# Altium project MotherPetit.PrjPCB
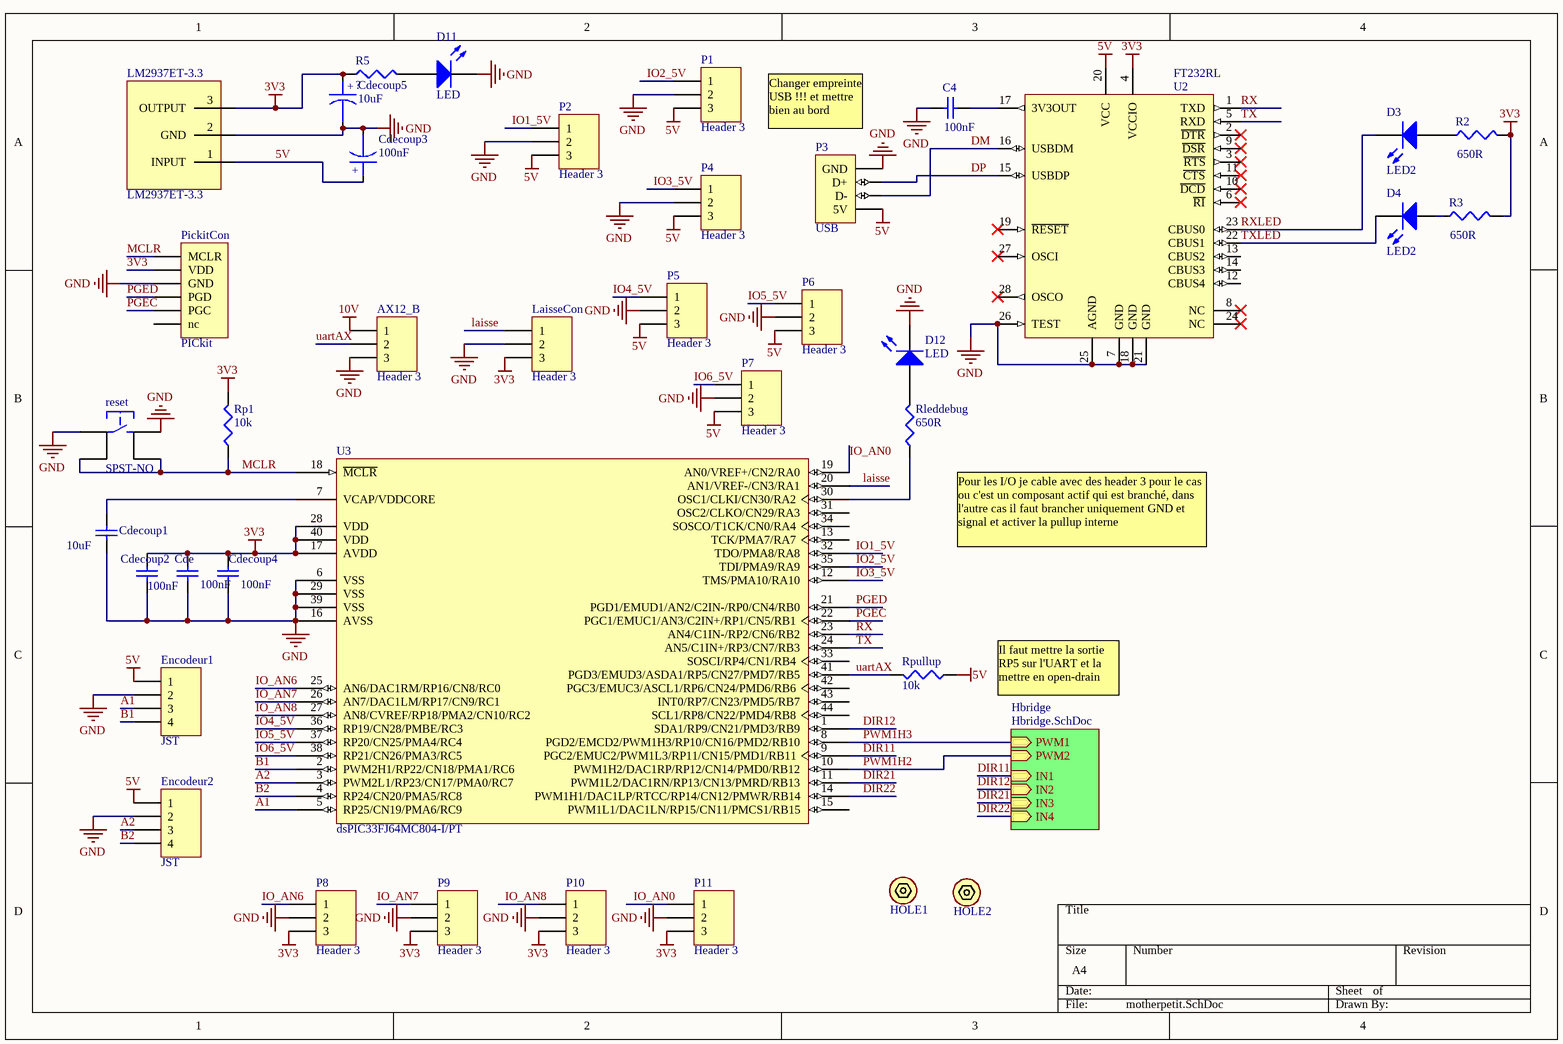
[diagram p0: motherpetit.SchDoc]
2 sheets, 57 parts. Net scope: hierarchical (ports join the sheet entries above them; power ports are global).
Board files: mother_asserv_robinch.PcbDoc, testbobot.PcbDoc
Sheets:
  motherpetit.SchDoc
    Hbridge = Hbridge.SchDoc

## Sheet motherpetit.SchDoc
size A4

### Parts
AX12_B  Header 3  [HDR1X3]
C4  value 100nF  [C0805C]
Cde  value 100nF  [C0805C]  (hidden comment: CAP)
Cdecoup1  value 10uF  [C0805C]  (hidden comment: CAP)
Cdecoup2  value 100nF  [C0805C]  (hidden comment: CAP)
Cdecoup3  value 100nF  [RB.1/.3]  (hidden comment: CAP Pol)
Cdecoup4  value 100nF  [C0805C]  (hidden comment: CAP)
Cdecoup5  value 10uF  [RB.1/.3]  (hidden comment: CAP Pol)
D3  LED2  [LED1206Y]
D4  LED2  [LED1206Y]
D11  LED  [LED1206R]
D12  LED  [LED1206G]
Encodeur1  JST  [B4B-PH-K-S]
Encodeur2  JST  [B4B-PH-K-S]
HOLE1  Hole  [SCREW]  (value not drawn)
HOLE2  Hole  [SCREW]  (value not drawn)
LaisseCon  Header 3  [HDR1X3]
LM2937ET-3.3  LM2937ET-3.3  [TO-220V]
P1  Header 3  [HDR1X3]
P2  Header 3  [HDR1X3]
P3  USB  [USB/SM0.8-4H5]
P4  Header 3  [HDR1X3]
P5  Header 3  [HDR1X3]
P6  Header 3  [HDR1X3]
P7  Header 3  [HDR1X3]
P8  Header 3  [HDR1X3]
P9  Header 3  [HDR1X3]
P10  Header 3  [HDR1X3]
P11  Header 3  [HDR1X3]
PickitCon  PICkit  [HDR1X6H]
R2  value 650R  [C0805R]
R3  value 650R  [C0805R]
R5  RES  [C0805R]  (value not drawn)
reset  SPST-NO  [SPST-NO]
Rleddebug  value 650R  [C0805R]
Rp1  value 10k  [C0805R]  (hidden comment: RES)
Rpullup  value 10k  [C0805R]  (hidden comment: RES)
U2  FT232RL  [SSOP-28_M]
U3  dsPIC33FJ64MC804-I/PT  [TQFP-PT44_N]

### Sub-sheets
Hbridge = Hbridge.SchDoc: IN1 (in), IN2 (in), IN3 (in), IN4 (in), PWM1 (in), PWM2 (in)

### Nets
3V3: Cde.2 Cdecoup2.2 Cdecoup4.2 Cdecoup5.1 LaisseCon.3 LM2937ET-3.3.3(OUTPUT) P8.3 P9.3 P10.3 P11.3 PickitCon.2(VDD) R2.2 R3.2 R5.1 Rp1.2 U2.4(VCCIO) U3.17(AVDD) U3.28(VDD) U3.40(VDD)
5V: Cdecoup3.1 Encodeur1.1 Encodeur2.1 LM2937ET-3.3.1(INPUT) P1.3 P2.3 P3.1(5V) P4.3 P5.3 P6.3 P7.3 Rpullup.1 U2.20(VCC)
10V: AX12_B.1
GND: AX12_B.3 C4.1 Cde.1 Cdecoup1.1 Cdecoup2.1 Cdecoup3.2 Cdecoup4.1 Cdecoup5.2 D11.2(K) D12.2(K) Encodeur1.2 Encodeur2.2 LaisseCon.2 LM2937ET-3.3.2(GND) P1.2 P2.2 P3.4(GND) P4.2 P5.2 P6.2 P7.2 P8.2 P9.2 P10.2 P11.2 PickitCon.3(GND) reset.1 reset.4 U2.7(GND) U2.18(GND) U2.21(GND) U2.25(AGND) U2.26(TEST) U3.6(VSS) U3.16(AVSS) U3.29(VSS) U3.39(VSS)
A1: Encodeur1.3 U3.5(RP25/CN19/PMA6/RC9)
A2: Encodeur2.3 U3.3(PWM2L1/RP23/CN17/PMA0/RC7)
B1: Encodeur1.4 U3.2(PWM2H1/RP22/CN18/PMA1/RC6)
B2: Encodeur2.4 U3.4(RP24/CN20/PMA5/RC8)
DIR11: U3.9(PGC2/EMUC2/PWM1L3/RP11/CN15/PMD1/RB11) ; sheet Hbridge/IN1
DIR12: U3.1(SDA1/RP9/CN21/PMD3/RB9) ; sheet Hbridge/IN2
DIR21: U3.11(PWM1L2/DAC1RN/RP13/CN13/PMRD/RB13) ; sheet Hbridge/IN3
DIR22: U3.14(PWM1H1/DAC1LP/RTCC/RP14/CN12/PMWR/RB14) ; sheet Hbridge/IN4
DM: P3.2(D-) U2.16(USBDM)
DP: P3.3(D+) U2.15(USBDP)
IO1_5V: P2.1 U3.32(TDO/PMA8/RA8)
IO2_5V: P1.1 U3.35(TDI/PMA9/RA9)
IO3_5V: P4.1 U3.12(TMS/PMA10/RA10)
IO4_5V: P5.1 U3.36(RP19/CN28/PMBE/RC3)
IO5_5V: P6.1 U3.37(RP20/CN25/PMA4/RC4)
IO6_5V: P7.1 U3.38(RP21/CN26/PMA3/RC5)
IO_AN0: P11.1 U3.19(AN0/VREF+/CN2/RA0)
IO_AN6: P8.1 U3.25(AN6/DAC1RM/RP16/CN8/RC0)
IO_AN7: P9.1 U3.26(AN7/DAC1LM/RP17/CN9/RC1)
IO_AN8: P10.1 U3.27(AN8/CVREF/RP18/PMA2/CN10/RC2)
laisse: LaisseCon.1 U3.20(AN1/VREF-/CN3/RA1)
MCLR: PickitCon.1(MCLR) reset.2 reset.3 Rp1.1 U3.18(~{MCLR})
PGEC: PickitCon.5(PGC) U3.22(PGC1/EMUC1/AN3/C2IN+/RP1/CN5/RB1)
PGED: PickitCon.4(PGD) U3.21(PGD1/EMUD1/AN2/C2IN-/RP0/CN4/RB0)
PWM1H2: U3.10(PWM1H2/DAC1RP/RP12/CN14/PMD0/RB12) ; sheet Hbridge/PWM2
PWM1H3: U3.8(PGD2/EMCD2/PWM1H3/RP10/CN16/PMD2/RB10) ; sheet Hbridge/PWM1
RX: U2.1(TXD) U3.23(AN4/C1IN-/RP2/CN6/RB2)
RXLED: D3.2(K) U2.23(CBUS0)
TX: U2.5(RXD) U3.24(AN5/C1IN+/RP3/CN7/RB3)
TXLED: D4.2(K) U2.22(CBUS1)
uartAX: AX12_B.2 Rpullup.2 U3.41(PGD3/EMUD3/ASDA1/RP5/CN27/PMD7/RB5)
NetC4_2: C4.2 U2.17(3V3OUT)
NetCdecoup1_2: Cdecoup1.2 U3.7(VCAP/VDDCORE)
NetD3_1: D3.1(A) R2.1
NetD4_1: D4.1(A) R3.1
NetD11_1: D11.1(A) R5.2
NetD12_1: D12.1(A) Rleddebug.2
NetRleddebug_1: Rleddebug.1 U3.30(OSC1/CLKI/CN30/RA2)

Not connected (* = marked no-connect by the designer): HOLE1 1(Hole); HOLE2 1(Hole); PickitCon 6(nc); U2 2(~{DTR})* 3(~{RTS})* 6(~{RI})* 8(NC)* 9(~{DSR})* 10(~{DCD})* 11(~{CTS})* 12(CBUS4) 13(CBUS2) 14(CBUS3) 19(~{RESET})* 24(NC)* 27(OSCI)* 28(OSCO)*; U3 13(TCK/PMA7/RA7) 15(PWM1L1/DAC1LN/RP15/CN11/PMCS1/RB15) 31(OSC2/CLKO/CN29/RA3) 33(SOSCI/RP4/CN1/RB4) 34(SOSCO/T1CK/CN0/RA4) 42(PGC3/EMUC3/ASCL1/RP6/CN24/PMD6/RB6) 43(INT0/RP7/CN23/PMD5/RB7) 44(SCL1/RP8/CN22/PMD4/RB8)

### Notes on the sheet
- (near P3) Changer empreinte USB !!! et mettre bien au bord
- Pour les I/O je cable avec des header 3 pour le cas ou c'est un composant actif qui est branché, dans l'autre cas il faut brancher uniquement GND et signal et activer la pullup interne
- Il faut mettre la sortie RP5 sur l'UART et la mettre en open-drain
- (in symbol CAP Pol) +

### Library data of the parts
AX12_B LaisseCon P1 P2 P4-P11 = Header 3: Header, 3-Pin; LatestRevisionDate: 17-Jul-2002; LatestRevisionNote: Re-released for DXP Platform.; Publisher: Altium Limited
C4 = Cap Semi: Capacitor (Semiconductor SIM Model); Published: 8-Jun-2000; LatestRevisionDate: 29-May-2009; LatestRevisionNote: IPC-7351 Footprint Added.; PackageReference: C1206; Publisher: Altium Limited; PackageDescription: Chip Capacitor
Cde Cdecoup1 Cdecoup2 Cdecoup4 = CAP: Capacitor; Published: 8-Jun-2000; LatestRevisionDate: 29-May-2009; LatestRevisionNote: IPC-7351 Footprint Added.; PackageReference: C1206; Publisher: Altium Limited; PackageDescription: Chip Capacitor
Cdecoup3 Cdecoup5 = CAP Pol: Polarized Capacitor
D3 D4 = LED2: Typical RED, GREEN, YELLOW, AMBER GaAs LED; Published: 8-Jun-2000; LatestRevisionDate: 17-Jul-2002; LatestRevisionNote: Re-released for DXP Platform.; PackageVersion: Feb-2002; PackageReference: 3.2X1.6X1.1; Publisher: Altium Limited; PackageDescription: SM LED; 2 Flat Leads
D11 D12 = LED: Typical LED; Published: 8-Jun-2000; LatestRevisionDate: 17-Jul-2002; LatestRevisionNote: Re-released for DXP Platform.; PackageVersion: Feb-2002; PackageReference: 3.2X1.6X1.1; Publisher: Altium Limited; PackageDescription: SM LED; 2 Flat Leads
Encodeur1 Encodeur2 = Header 4: Header, 4-Pin; LatestRevisionDate: 17-Jul-2002; LatestRevisionNote: Re-released for DXP Platform.; Publisher: Altium Limited
HOLE1 HOLE2 = Hole: Mounting Hole for screws
LM2937ET-3.3 = LM2937ET-3.3: 3.3V linear Regulator
P3 = USB Con: USB Connector; LatestRevisionDate: 17-Jul-2002; LatestRevisionNote: Re-released for DXP Platform.; Publisher: Altium Limited
PickitCon = Header ICSP: Header, 6-Pin, Right Angle; LatestRevisionDate: 17-Jul-2002; LatestRevisionNote: Re-released for DXP Platform.; Publisher: Altium Limited
R2 R3 Rleddebug = Res3: Resistor; Published: 8-Jun-2000; LatestRevisionDate: 29-May-2009; LatestRevisionNote: IPC-7351 Footprint Added.; PackageReference: J1-0603; Publisher: Altium Limited; PackageDescription: Chip Resistor
R5 Rp1 Rpullup = RES: Resistor; Published: 8-Jun-2000; LatestRevisionDate: 29-May-2009; LatestRevisionNote: IPC-7351 Footprint Added.; PackageReference: J1-0603; Publisher: Altium Limited; PackageDescription: Chip Resistor
  R5: Value: ?
reset = SPST-NO: Tactile Switch 7.3mm, SMD
U2 = FT232RL: USB UART Asynchronous Serial Data Transfer Chip, SSOP-28, Tube; Published: 19-Aug-2010; DatasheetVersion: ver 2.07, Jul-2010; PackageVersion: 2010; PackageReference: SSOP-28; Publisher: Altium Limited; PackageDescription: 28-Pin Small Outline Package 0.65 mm Pitch; ComponentLink1Description: Manufacturer Link; ComponentLink1URL: http://www.ftdichip.com/Products/ICs/FT232R.htm; ComponentLink2Description: Datasheet; ComponentLink2URL: http://www.ftdichip.com/Support/Documents/DataSheets/ICs/DS_FT232R.pdf
U3 = dsPIC33FJ64MC804-I/PT: High-Performance 16-bit Digital Signal Controller, 64 KB Flash, 16 KB RAM, 44-Pin TQFP, Industrial Temperature; Published: 2-Dec-2009; DatasheetVersion: revD, Nov-2009; PackageVersion: revBB, Aug-2009; PackageReference: TQFP-PT44; Publisher: Altium Limited; PackageDescription: 44-Lead Plastic Thin Quad Flatpack (PT) - 10x10x1mm Body, 2.00mm [TQFP]; Supplier 1: Digi-Key; Supplier Part Number 1: DSPIC33FJ64MC804-I/PT-ND; Supplier 2: Farnell; Supplier Part Number 2: 1576844; Code_JEDEC: MS-026; ComponentLink1Description: Datasheet; ComponentLink1URL: http://ww1.microchip.com/downloads/en/DeviceDoc/70291D.pdf; ComponentLink2Description: Packaging Specification; ComponentLink2URL: http://www.microchip.com/stellent/groups/techpub_sg/documents/packagingspec/en012702.pdf; ComponentLink3Description: Microchip.com Home; ComponentLink3URL: http://www.microchip.com/

## Sheet Hbridge.SchDoc
size A4
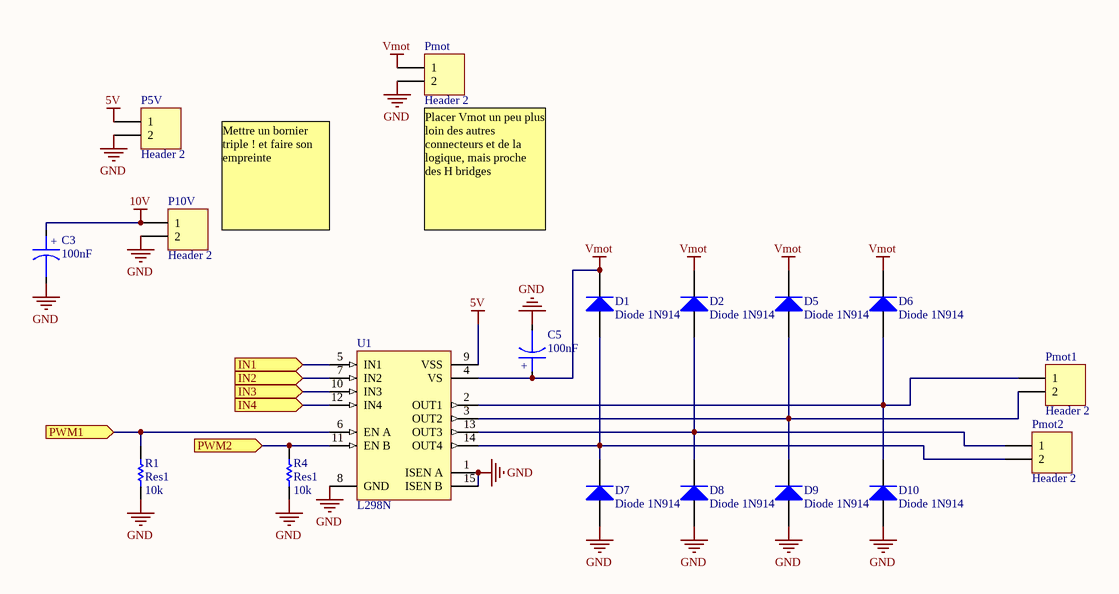
[diagram p1: Hbridge.SchDoc]

### Parts
C3  value 100nF  [RB.1/.3]  (hidden comment: CAP Pol)
C5  value 100nF  [RB.2/.4]  (hidden comment: CAP Pol)
D1  Diode 1N914  [DO-35]
D2  Diode 1N914  [DO-35]
D5  Diode 1N914  [DO-35]
D6  Diode 1N914  [DO-35]
D7  Diode 1N914  [DO-35]
D8  Diode 1N914  [DO-35]
D9  Diode 1N914  [DO-35]
D10  Diode 1N914  [DO-35]
P5V  Header 2  [Bornier male coude 2 voies]
P10V  Header 2  [Bornier male coude 2 voies]
Pmot  Header 2  [Bornier male coude 2 voies]
Pmot1  Header 2  [TERM2W-3.5]
Pmot2  Header 2  [TERM2W-3.5]
R1  Res1  value 10k  [AXIAL-0.3]
R4  Res1  value 10k  [AXIAL-0.3]
U1  L298N  [Multiwatt15V]

### Ports
IN1 (in), IN2 (in), IN3 (in), IN4 (in), PWM1 (in), PWM2 (in)

### Nets
5V: P5V.1 U1.9(VSS)
10V: C3.1 P10V.1
GND: C3.2 C5.2 D7.1(A) D8.1(A) D9.1(A) D10.1(A) P5V.2 P10V.2 Pmot.2 R1.1 R4.1 U1.1(ISEN_A) U1.8(GND) U1.15(ISEN_B)
Vmot: C5.1 D1.2(K) D2.2(K) D5.2(K) D6.2(K) Pmot.1 U1.4(VS)
DIR11: U1.5(IN1) ; port IN1
DIR12: U1.7(IN2) ; port IN2
DIR21: U1.10(IN3) ; port IN3
DIR22: U1.12(IN4) ; port IN4
PWM1H2: R4.2 U1.11(EN_B) ; port PWM2
PWM1H3: R1.2 U1.6(EN_A) ; port PWM1
NetD1_1: D1.1(A) D7.2(K) Pmot2.2 U1.14(OUT4)
NetD2_1: D2.1(A) D8.2(K) Pmot2.1 U1.13(OUT3)
NetD5_1: D5.1(A) D9.2(K) Pmot1.2 U1.3(OUT2)
NetD6_1: D6.1(A) D10.2(K) Pmot1.1 U1.2(OUT1)

### Notes on the sheet
- Mettre un bornier triple ! et faire son empreinte
- (near Pmot) Placer Vmot un peu plus loin des autres connecteurs et de la logique, mais proche des H bridges
- (in symbol CAP Pol) +

### Library data of the parts
C3 C5 = CAP Pol: Polarized Capacitor
D1 D2 D5-D10 = Diode 1N914: High Conductance Fast Diode; Published: 8-Jun-2000; LatestRevisionDate: 17-Jul-2002; LatestRevisionNote: Re-released for DXP Platform.; DatasheetVersion: 1997; PackageReference: DO-35; Publisher: Altium Limited; PackageDescription: Diode, Axial; Body 3.8 x 1.9 mm (LxDia. max), Lead Dia. 0.53 mm (max); Code_JEDEC: DO-204-AH; ComponentLink1Description: Manufacturer Link; ComponentLink1URL: http://www.fairchildsemi.com/; ComponentLink2Description: Datasheet; ComponentLink2URL: http://www.fairchildsemi.com/ds/1N%2F1N4448.pdf
P5V P10V Pmot Pmot1 Pmot2 = Header 2: Header, 2-Pin; LatestRevisionDate: 17-Jul-2002; LatestRevisionNote: Re-released for DXP Platform.; Publisher: Altium Limited
R1 R4 = Res1: Resistor; Published: 8-Jun-2000; LatestRevisionDate: 17-Jul-2002; LatestRevisionNote: Re-released for DXP Platform.; PackageReference: AXIAL-0.3; Publisher: Altium Limited; PackageDescription: Axial Device, Thru-Hole; 2 Leads; 0.3 in Pin Spacing
U1 = L298N: Dual Full Bridge Driver; Published: 8-Jun-2000; LatestRevisionDate: 14-May-2007; LatestRevisionNote: Mapped to vertical PCB.; DatasheetVersion: Jul-1999; PackageReference: Multiwatt15V; Publisher: Altium Limited; PackageDescription: TO, Thru-Hole, Vertical, Heatsink Mounted; 15 Bent Staggered Leads; Pitch 1.27 mm; ComponentLink1Description: Manufacturer Link; ComponentLink1URL: http://www.st.com/; ComponentLink2Description: Datasheet; ComponentLink2URL: http://www.st.com/stonline/products/literature/ds/1773/l298.pdf

## Nets that join several sheets
5V: motherpetit (13 pins), Hbridge (P5V.1 U1.9)
10V: motherpetit (AX12_B.1), Hbridge (C3.1 P10V.1)
GND: motherpetit (37 pins), Hbridge (14 pins)
DIR11: motherpetit (U3.9), Hbridge (U1.5)
DIR12: motherpetit (U3.1), Hbridge (U1.7)
DIR21: motherpetit (U3.11), Hbridge (U1.10)
DIR22: motherpetit (U3.14), Hbridge (U1.12)
PWM1H2: motherpetit (U3.10), Hbridge (R4.2 U1.11)
PWM1H3: motherpetit (U3.8), Hbridge (R1.2 U1.6)